# EAGLE design Teensy_backpack_proto (EAGLE 8.0.1)
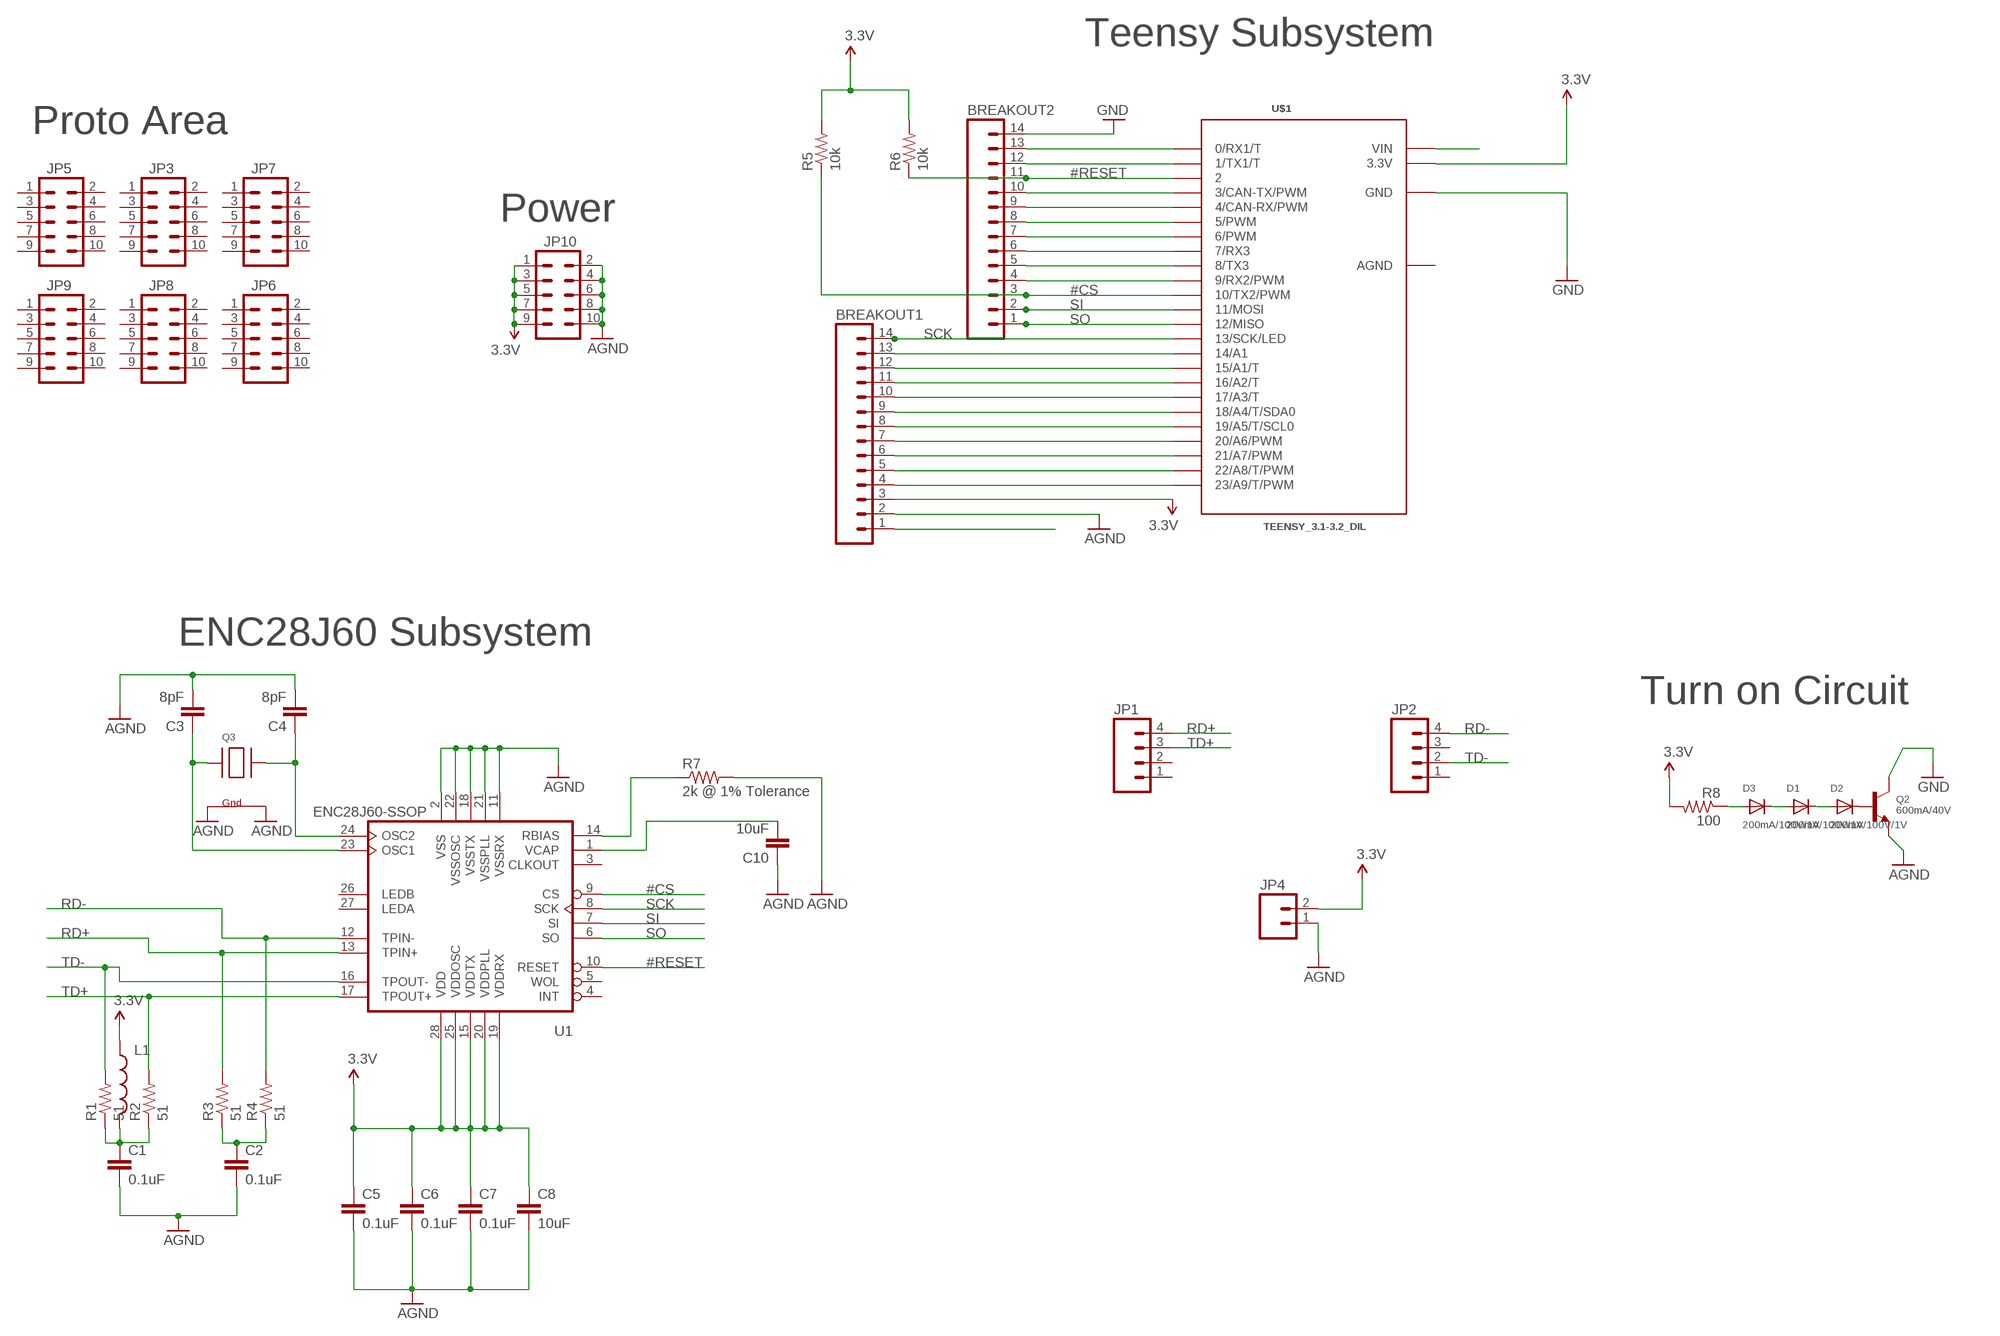
[diagram p0: schematic, sheet 1]

## Parts
BREAKOUT1  M14  [1X14]
BREAKOUT2  M14  [1X14]
C1  0.1uF  CAP0603-CAP  [0603-CAP]
C2  0.1uF  CAP0603-CAP  [0603-CAP]
C3  8pF  CAP0603-CAP  [0603-CAP]
C4  8pF  CAP0603-CAP  [0603-CAP]
C5  0.1uF  CAP0603-CAP  [0603-CAP]
C6  0.1uF  CAP0603-CAP  [0603-CAP]
C7  0.1uF  CAP0603-CAP  [0603-CAP]
C8  10uF  CAP0603-CAP  [0603-CAP]
C10  10uF  CAP0603-CAP  [0603-CAP]
D1  200mA/100V/1V  DIODESOD-123  [SOD-123]
D2  200mA/100V/1V  DIODESOD-123  [SOD-123]
D3  200mA/100V/1V  DIODESOD-123  [SOD-123]
JP1  M04NO_SILK_ALL_ROUND  [1X04_NO_SILK_ALL_ROUND]
JP2  M04NO_SILK_ALL_ROUND  [1X04_NO_SILK_ALL_ROUND]
JP3  M05X2NO_SILK  [2X5_NOSILK]
JP4  M021X02_NO_SILK  [1X02_NO_SILK]
JP5  M05X2NO_SILK  [2X5_NOSILK]
JP6  M05X2NO_SILK  [2X5_NOSILK]
JP7  M05X2NO_SILK  [2X5_NOSILK]
JP8  M05X2NO_SILK  [2X5_NOSILK]
JP9  M05X2NO_SILK  [2X5_NOSILK]
JP10  M05X2NO_SILK  [2X5_NOSILK]
L1  INDUCTOR0603  [0603]
Q2  600mA/40V  TRANSISTOR_NPN  [SOT23-R]
Q3  XTAL-4-3225  [NX3225]
R1  51  RESISTOR0603  [0603-RES]
R2  51  RESISTOR0603  [0603-RES]
R3  51  RESISTOR0603  [0603-RES]
R4  51  RESISTOR0603  [0603-RES]
R5  10k  RESISTOR0603  [0603-RES]
R6  10k  RESISTOR0603  [0603-RES]
R7  2k @ 1% Tolerance  RESISTOR0603-RES  [0603-RES]
R8  100  RESISTOR0603  [0603-RES]
U1  ENC28J60-SSOP  [SSOP28]
U$1  TEENSY_3.1-3.2_DIL  [TEENSY_3.0-3.2&LC_DIL]

## Nets
3.3V: BREAKOUT1.3 C5.1 C6.1 C7.1 C8.1 JP4.2 JP10.1 JP10.3 JP10.5 JP10.7 JP10.9 L1.1 R5.2 R6.2 R8.2 U1.15(VDDTX) U1.19(VDDRX) U1.20(VDDPLL) U1.25(VDDOSC) U1.28(VDD) U$1.3.3V
#CS: BREAKOUT2.3 R5.1 U1.9(CS) U$1.10(10/TX2/PWM)
#RESET: BREAKOUT2.11 R6.1 U1.10(RESET) U$1.2
AGND: BREAKOUT1.2 C1.2 C2.2 C3.2 C4.2 C5.2 C6.2 C7.2 C8.2 C10.1 JP4.1 JP10.2 JP10.4 JP10.6 JP10.8 JP10.10 Q2.2(E) Q3.2(G2) Q3.4(G1) R7.2 U1.2(VSS) U1.11(VSSRX) U1.18(VSSTX) U1.21(VSSPLL) U1.22(VSSOSC)
GND: BREAKOUT2.14 Q2.3(C) U$1.GND
N$1: D1.C D2.A
N$2: D2.C Q2.1(B)
N$3: D1.A D3.C
N$4: D3.A R8.1
N$5: C2.1 R3.1 R4.1
N$6: BREAKOUT2.4 U$1.9(9/RX2/PWM)
N$7: C1.1 L1.2 R1.1 R2.1
N$8: BREAKOUT2.5 U$1.8(8/TX3)
N$9: BREAKOUT2.6 U$1.7(7/RX3)
N$10: BREAKOUT2.7 U$1.6(6/PWM)
N$11: BREAKOUT2.8 U$1.5(5/PWM)
N$12: C3.1 Q3.1(X1) U1.23(OSC1)
N$13: C4.1 Q3.3(X2) U1.24(OSC2)
N$14: BREAKOUT2.9 U$1.4(4/CAN-RX/PWM)
N$15: R7.1 U1.14(RBIAS)
N$16: BREAKOUT2.10 U$1.3(3/CAN-TX/PWM)
N$17: C10.2 U1.1(VCAP)
N$18: BREAKOUT2.12 U$1.1(1/TX1/T)
N$19: BREAKOUT2.13 U$1.0(0/RX1/T)
N$20: BREAKOUT1.4 U$1.23/A9(23/A9/T/PWM)
N$21: BREAKOUT1.5 U$1.22/A8(22/A8/T/PWM)
N$22: BREAKOUT1.6 U$1.21/A7(21/A7/PWM)
N$23: BREAKOUT1.7 U$1.20/A6(20/A6/PWM)
N$24: BREAKOUT1.8 U$1.19/A5(19/A5/T/SCL0)
N$25: BREAKOUT1.9 U$1.18/A4(18/A4/T/SDA0)
N$26: BREAKOUT1.10 U$1.17/A3(17/A3/T)
N$27: BREAKOUT1.11 U$1.16/A2(16/A2/T)
N$28: BREAKOUT1.12 U$1.15/A1(15/A1/T)
N$29: BREAKOUT1.13 U$1.14/A0(14/A1)
RD+: JP1.4 R3.2 U1.13(TPIN+)
RD-: JP2.4 R4.2 U1.12(TPIN-)
SCK: BREAKOUT1.14 U1.8(SCK) U$1.13(13/SCK/LED)
SI: BREAKOUT2.2 U1.7(SI) U$1.11(11/MOSI)
SO: BREAKOUT2.1 U1.6(SO) U$1.12(12/MISO)
TD+: JP1.3 R2.2 U1.17(TPOUT+)
TD-: JP2.2 R1.2 U1.16(TPOUT-)
TEENSY_VIN: BREAKOUT1.1 U$1.VIN
Unconnected: JP1.1 JP1.2 JP2.1 JP2.3 JP3.1 JP3.2 JP3.3 JP3.4 JP3.5 JP3.6 JP3.7 JP3.8 JP3.9 JP3.10 JP5.1 JP5.2 JP5.3 JP5.4 JP5.5 JP5.6 JP5.7 JP5.8 JP5.9 JP5.10 JP6.1 JP6.2 JP6.3 JP6.4 JP6.5 JP6.6 JP6.7 JP6.8 JP6.9 JP6.10 JP7.1 JP7.2 JP7.3 JP7.4 JP7.5 JP7.6 JP7.7 JP7.8 JP7.9 JP7.10 JP8.1 JP8.2 JP8.3 JP8.4 JP8.5 JP8.6 JP8.7 JP8.8 JP8.9 JP8.10 JP9.1 JP9.2 JP9.3 JP9.4 JP9.5 JP9.6 JP9.7 JP9.8 JP9.9 JP9.10 U1.3(CLKOUT) U1.4(INT) U1.5(WOL) U1.26(LEDB) U1.27(LEDA)

## Notes on the sheet
- Teensy Subsystem
- Proto Area
- Power
- ENC28J60 Subsystem
- Turn on Circuit

## Power pins joined to a net without a drawn wire
AGND: U$1.AGND

## Library data of the parts
BREAKOUT1 BREAKOUT2 = SparkFun-Connectors:M14: Header 14 Standard 14-pin 0.1" header. Use with straight break away headers (SKU : PRT-00116), right angle break away headers (PRT-00553), swiss pins (PRT-00743), machine pins (PRT-00117), and female headers (PRT-00115).
C1 C2 C5-C7 = SparkFun-Capacitors:CAP: Capacitor Standard 0603 ceramic capacitor, and 0.1" leaded capacitor.
C3 C4 C8 C10 = SparkFun-Passives:CAP: Capacitor Standard 0603 ceramic capacitor, and 0.1" leaded capacitor.
D1-D3 = adafruit:DIODE: Diode SMADIODE - SMA Surface Mount Package 20V 1A Schottky Diode Digikey: 641-1014-6-ND DO-1N4148 - Through Hole Small Current Diode SOD-123 20V 1 A (.5mV Vf) Schottky Diode - Digikey: MBRX120TPMSCT-ND SOD-323 10V 570mA (.38mV Vf, 3ns) Schottky Diode - Digikey: ZLLS410CT-ND SOD-523 30V 30mA Schottky Diode (RB751S-40TE61) - Digikey: RB751S-40TE61CT-ND SOT23-R/W - SOT23 Package (R = Solder Paste/Reflow Ovens, W = Hand-Soldering) BAT54Film 40V 300mA - Digikey: 497-7162-1-ND
JP1 JP2 = SparkFun-Connectors:M04: Header 4 Standard 4-pin 0.1" header. Use with straight break away headers (SKU : PRT-00116), right angle break away headers (PRT-00553), swiss pins (PRT-00743), machine pins (PRT-00117), and female headers (PRT-00115). Molex polarized connector foot print use with SKU : PRT-08231 with associated crimp pins and housings. 1MM SMD Version SKU: PRT-10208
JP3 JP5-JP10 = SparkFun-Connectors:M05X2: Header 5x2 Standard 10-pin dual row 0.1" header. Commonly used with AVR-ISP. Use with Spark Fun Electronics SKU: PRT-00778
JP4 = SparkFun-Connectors:M02: Standard 2-pin 0.1" header. Use with - straight break away headers ( PRT-00116) - right angle break away headers (PRT-00553) - swiss pins (PRT-00743) - machine pins (PRT-00117) - female headers (PRT-00115) Molex polarized connector foot print use with: PRT-08233 with associated crimp pins and housings. 2.54_SCREWTERM for use with PRT-10571. 3.5mm Screw Terminal footprints for PRT-08084 5mm Screw Terminal footprints for use with PRT-08432
L1 = SparkFun-Passives:INDUCTOR: Inductors Basic Inductor/Choke - 0603 and 1206. Footprints are not proven and vary greatly between part numbers. INDUCTOR POWER 3.3UH 4.0A SMD 0.197" L x 0.197" W x 0.177" H (5.00mm x 5.00mm x 4.50mm)
Q2 = microbuilder:TRANSISTOR_NPN: NPN Transistor Transistor (NPN) 500mA 45V - BC817 [Digikey: 568-1631-1-ND] Transistor (NPN) 500mA 45V - BC817,215 [Mouser: 771-BC817-T/R] SOT23-R - SOT23 footprint optimised for use with solder paste and reflow ovens. SOT23-W - SOT23 footprint optimised for hand-soldering (larger pads).
Q3 = adafruit:XTAL-4: Classic 4-pin 3.2 x 2.5mm crystal
R1-R6 R8 = SparkFun-Resistors:RESISTOR: Resistor Basic schematic elements and footprints for 0603, 1206, and PTH resistors.
R7 = SparkFun-Passives:RESISTOR: Resistor Basic schematic elements and footprints for 0603, 1206, and PTH resistors.
U1 = microchip-enc28j60:ENC28J60-*: Microchip 10Mbit Eth. contoller with SPI interface
U$1 = Teensy_3_and_LC_Series_Boards_v1.4:TEENSY_3.1-3.2_DIL: Teensy 3.1 or 3.2 in a DIL Layout.

## Board
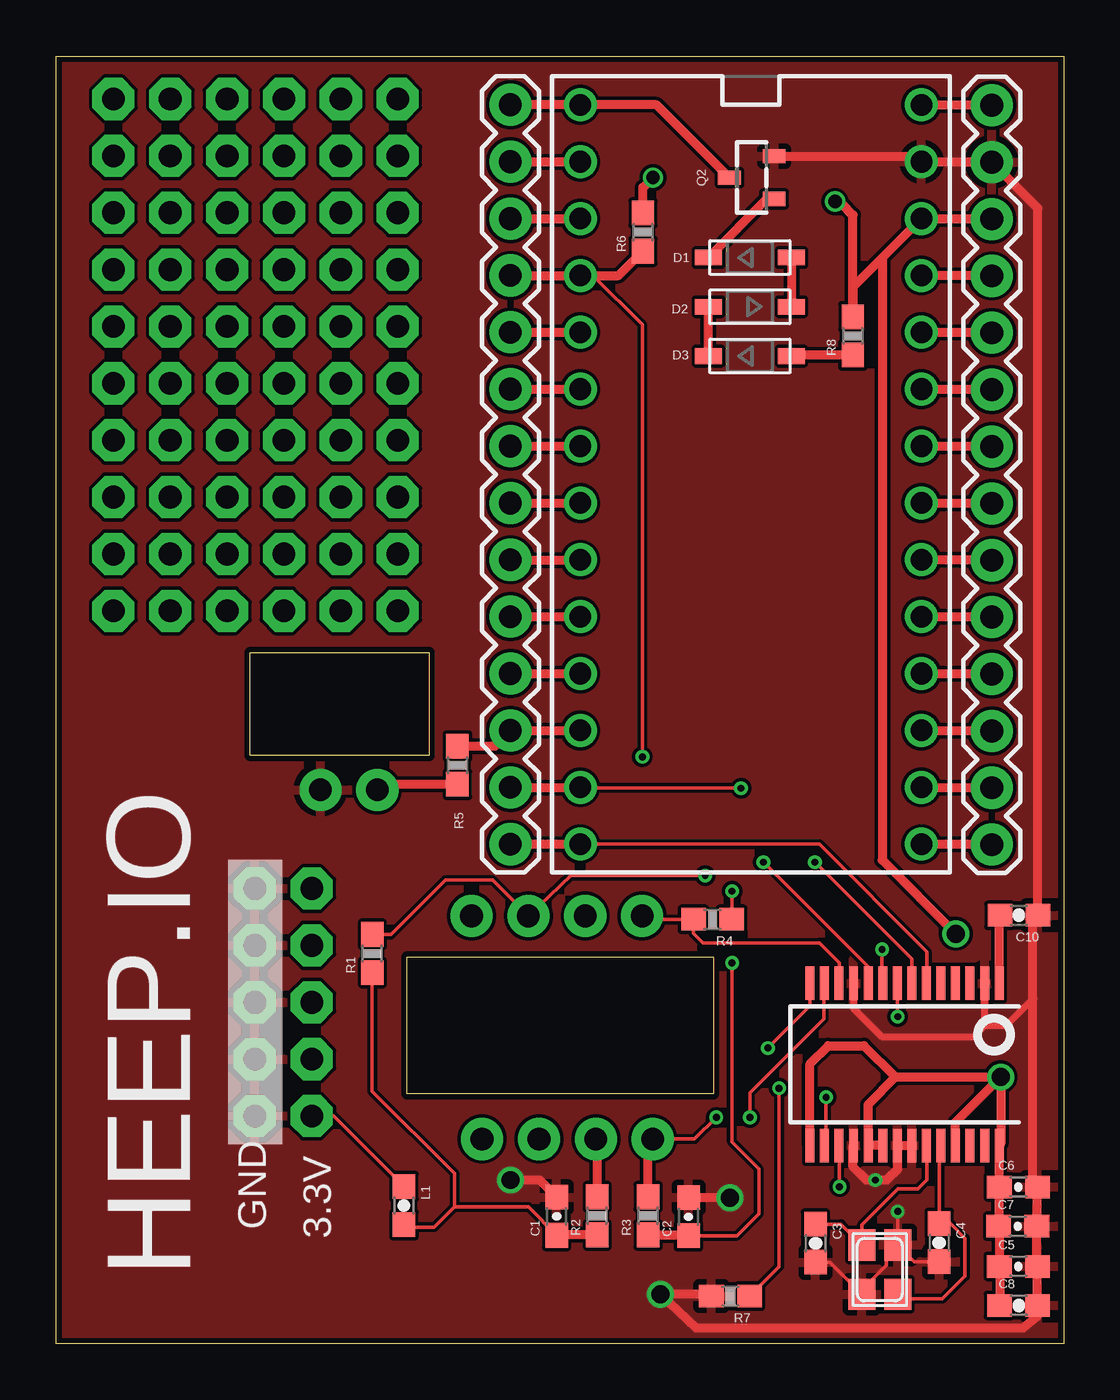
[diagram p1: board, top side]
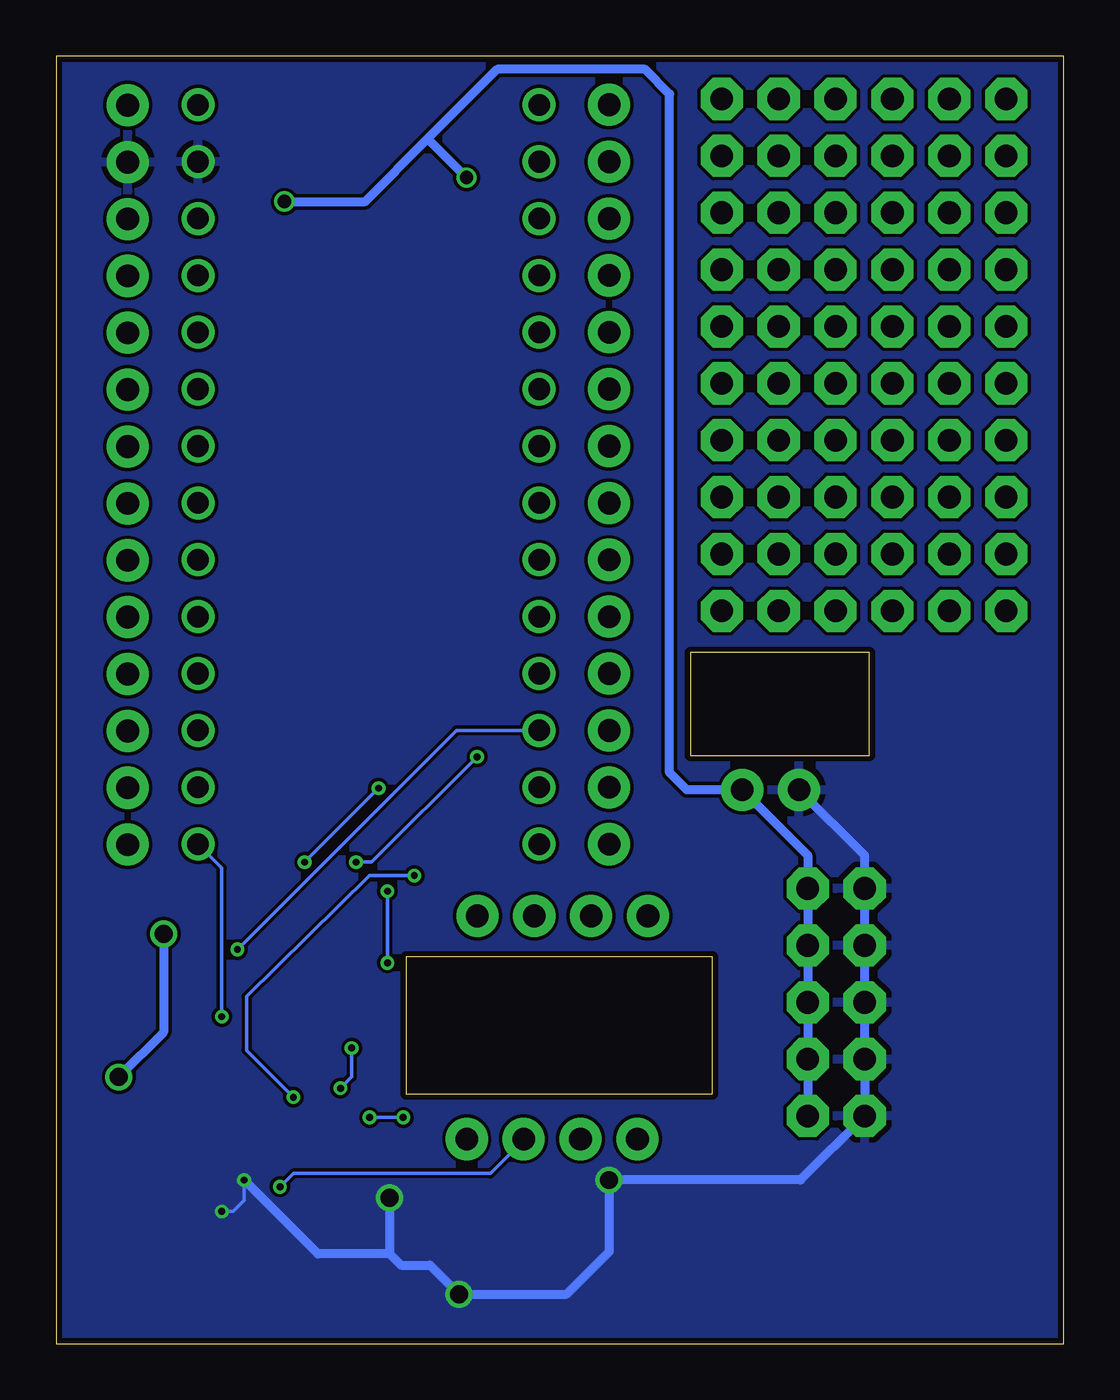
[diagram p2: board, bottom side, seen from below]

Size 45 x 57.5 mm. Coordinates in mm from the lower left corner, seen from the top.
Outline: 45,0 0,0 0,57.5 45,57.5 45,0
Outline: 29.37,11.15 15.67,11.15 15.67,17.27 29.37,17.27 29.37,11.15
Outline: 16.66,26.27 8.66,26.27 8.66,30.87 16.66,30.87 16.66,26.27
Copper layers (1*16): Top 0.035mm / dielectric 1.5mm / Bottom 0.035mm
Design rules "SeeedStudio_2layer_DRU_no_angle_20140221": minimum track width 6mil, minimum drill 12mil, track to track 6mil, track to pad 6mil, pad to pad 6mil, via to via 6mil, smd to smd 0mil, copper to edge 10mil, drill to drill 10mil, minimum pad ring 10mil, minimum via ring 6mil, stop-mask expansion 2mil, vias tented up to drill 100mil, thermal gap 10mil

### Footprints (pad centres in the part's own frame; a part is rotated, then mirrored left to right if it is on the bottom)
1X14 = drill 1.016 pad 1.88: 1 0,0; 2 2.54,0; 3 5.08,0; 4 7.62,0; 5 10.16,0; 6 12.7,0; 7 15.24,0; 8 17.78,0; 9 20.32,0; 10 22.86,0; 11 25.4,0; 12 27.94,0; 13 30.48,0; 14 33.02,0
0603-CAP = smd 1.1 x 1: 1 -0.85,0; 2 0.85,0
SOD-123 = smd 1.2 x 0.7: A 1.85,0; C -1.85,0
1X04_NO_SILK_ALL_ROUND = drill 1.016 pad 1.88: 1 0,0; 2 2.54,0; 3 5.08,0; 4 7.62,0
2X5_NOSILK = drill 1.016 pad 1.88 octagon: 1 -1.27,5.08; 2 1.27,5.08; 3 -1.27,2.54; 4 1.27,2.54; 5 -1.27,0; 6 1.27,0; 7 -1.27,-2.54; 8 1.27,-2.54; 9 -1.27,-5.08; 10 1.27,-5.08
1X02_NO_SILK = drill 1.016 pad 1.88: 1 0,0; 2 2.54,0
0603 = smd 1.1 x 1: 1 -0.85,0; 2 0.85,0
SOT23-R = smd 0.635 x 1.016: 1 -0.95,-1; 2 0.95,-1; 3 0,1
NX3225 = smd 1.4 x 1.2: 1 -1.1,-0.8; 2 1.1,-0.8; 3 1.1,0.8; 4 -1.1,0.8
0603-RES = smd 1.1 x 1: 1 -0.85,0; 2 0.85,0
SSOP28 = smd 0.4 x 1.5: 1 -4.225,-3.625; 2 -3.575,-3.625; 3 -2.925,-3.625; 4 -2.275,-3.625; 5 -1.625,-3.625; 6 -0.975,-3.625; 7 -0.325,-3.625; 8 0.325,-3.625; 9 0.975,-3.625; 10 1.625,-3.625; 11 2.275,-3.625; 12 2.925,-3.625; 13 3.575,-3.625; 14 4.225,-3.625; 15 4.225,3.625; 16 3.575,3.625; 17 2.925,3.625; 18 2.275,3.625; 19 1.625,3.625; 20 0.975,3.625; 21 0.325,3.625; 22 -0.325,3.625; 23 -0.975,3.625; 24 -1.625,3.625; 25 -2.275,3.625; 26 -2.925,3.625; 27 -3.575,3.625; 28 -4.225,3.625
TEENSY_3.0-3.2&LC_DIL = drill 0.965: 0 -7.62,13.97; 1 -7.62,11.43; 2 -7.62,8.89; 3 -7.62,6.35; 3.3V 7.62,11.43; 4 -7.62,3.81; 5 -7.62,1.27; 6 -7.62,-1.27; 7 -7.62,-3.81; 8 -7.62,-6.35; 9 -7.62,-8.89; 10 -7.62,-11.43; 11 -7.62,-13.97; 12 -7.62,-16.51; 13 7.62,-16.51; 14/A0 7.62,-13.97; 15/A1 7.62,-11.43; 16/A2 7.62,-8.89; 17/A3 7.62,-6.35; 18/A4 7.62,-3.81; 19/A5 7.62,-1.27; 20/A6 7.62,1.27; 21/A7 7.62,3.81; 22/A8 7.62,6.35; 23/A9 7.62,8.89; AGND 7.62,13.97; GND -7.62,16.51; VIN 7.62,16.51

### Placement (x,y rotation side)
BREAKOUT1  41.79,55.3 270 top
BREAKOUT2  20.29,22.3 90 top
C1  22.36,5.68 90 top
C2  28.25,5.67 90 top
C3  33.92,4.48 270 top
C4  39.44,4.51 270 top
C5  42.98,3.44 0 top
C6  42.98,6.99 0 top
C7  42.95,5.24 0 top
C8  42.99,1.7 0 top
C10  43.01,19.12 180 top
D1  30.99,46.3 180 top
D2  30.99,48.5 0 top
D3  30.99,44.1 0 top
JP1  19.03,9.13 0 top
JP2  18.56,19.09 0 top
JP3  3.83,50.5 0 top
JP4  11.81,24.73 0 top
JP5  8.91,50.5 0 top
JP6  3.83,37.8 0 top
JP7  13.99,50.5 180 top
JP8  8.91,37.8 0 top
JP9  13.99,37.8 0 top
JP10  10.15,15.24 180 top
L1  15.54,6.16 270 top
Q2  31.08,52.07 90 top
Q3  36.79,3.3 270 top
R1  14.13,17.42 90 top
R2  24.17,5.7 90 top
R3  26.45,5.7 90 top
R4  29.33,18.94 180 top
R5  17.93,25.83 270 top
R6  26.21,49.64 90 top
R7  30.13,2.11 180 top
R8  35.59,45 90 top
U1  37.9,12.47 180 top
U$1  31.04,38.81 0 top

### Tracks (layer width: path | path; a pad name or v marks a point on that pad's centre or on a via)
3.3V  (via drill 0.6, 0.8)
  Top 0.152: L1.1 12.39,10.16 JP10.1
  Top 0.406: C8.1 C5.1 42.13,5.24 C7.1 42.13,5.24 C6.1 U1.28 42.19,8.91 v42.19,11.9 | 36.9,48.49 35.59,47.18 R8.2 35.59,50.4 35.09,50.9 34.89,50.9 v34.79,51 | 36.9,48.49 U$1.3.3V 41.77,50.24 BREAKOUT1.3 | R6.2 26.21,51.62 v26.66,52.07 | 36.9,48.49 36.9,21.59 v40.19,18.3 | U1.25 40.17,9.88 v42.19,11.9 | 37.49,11.9 36.27,10.68 U1.19 U1.20 | 37.49,11.9 v42.19,11.9 | U1.15 33.67,12.48 34.49,13.3 36.09,13.3 37.49,11.9 | R5.2 14.6,24.98 JP4.2
  Bottom 0.406: v34.79,51 31.19,51 28.39,53.8 | 28.39,53.8 25.29,56.9 18.69,56.9 17.59,55.8 17.59,25.5 16.82,24.73 JP4.2 11.42,21.8 JP10.9 JP10.7 JP10.5 JP10.3 JP10.1 | v26.66,52.07 28.39,53.8 | v40.19,18.3 40.19,13.9 v42.19,11.9
#CS  (via drill 0.3)
  Top 0.152: v36.89,17.6 36.89,16.12 U1.9
  Top 0.406: U$1.10 BREAKOUT2.3 19.59,26.68 R5.1
  Bottom 0.152: U$1.10 27.11,27.38 v36.89,17.6
#RESET  (via drill 0.3)
  Top 0.152: U1.10 36.27,16.82 v31.59,21.5 | v26.19,26.2 26.19,45.5 23.99,47.7
  Top 0.406: BREAKOUT2.11 U$1.2 23.99,47.7 25.13,47.7 R6.1
  Bottom 0.152: v31.59,21.5 30.89,21.5 v26.19,26.2
AGND  (via drill 0.3, 0.8)
  Top 0.152: C3.2 34.56,3.63 Q3.2 35.99,2.4 37.09,3.5 37.09,3.9 Q3.4 | C4.2 38.33,3.66 Q3.4 | Q3.4 v37.59,5.9
  Top 0.305: U1.11 35.62,14.97 36.89,13.7 40.99,13.7 41.49,14.2 | 41.49,14.2 41.49,16.07 U1.2 | 41.49,14.2 42.43,14.2 43.63,15.4
  Top 0.406: Q2.2 38.42,53.02 U$1.AGND 38.68,52.76 BREAKOUT1.2 43.86,50.7 C10.1 43.63,18.9 43.63,15.4 43.63,7.19 C6.2 43.83,5.24 C7.2 43.8,3.44 C5.2 C8.2 43.84,1.25 43.19,0.7 28.59,0.7 v26.99,2.2 29.19,2.2 R7.2 | U1.22 U1.21 37.59,8.82 37.59,7.8 37.09,7.3 v36.59,7.3 36.19,7.3 35.59,7.9 35.59,8.81 U1.18 | v20.29,7.3 21.6,7.3 C1.2 | C2.2 30.07,6.52 v30.09,6.5
  Bottom 0.152: JP10.2 | v36.59,7.3 36.59,6.4 37.09,5.9 v37.59,5.9
  Bottom 0.406: JP4.1 8.88,21.8 JP10.10 JP10.8 JP10.6 JP10.4 JP10.2 11.74,7.3 v20.29,7.3 20.29,4.1 22.19,2.2 v26.99,2.2 28.29,3.5 29.59,3.5 30.09,4 | v30.09,6.5 30.09,4 | 30.09,4 33.29,4 v36.59,7.3
  pour Top: -7.91,59.4 49.19,59.4 49.19,-3.3 -7.81,-3.3 -7.91,-3.3
  pour Bottom: -9.01,59.4 48.09,59.4 48.09,-3.3 -8.91,-3.3 -9.01,-3.3
GND
  Top 0.406: Q2.3 26.82,55.32 U$1.GND BREAKOUT2.14
N$1
  Top 0.406: D2.A D1.C
N$2
  Top 0.406: Q2.1 31.76,51.12 D2.C
N$3
  Top 0.406: D3.C D1.A
N$4
  Top 0.406: R8.1 32.89,44.15 D3.A
N$5  (via drill 0.3)
  Top 0.152: v30.19,20.2 30.19,18.96 R4.1 | C2.1 30.41,4.82 31.39,5.8 31.39,7.8 30.19,9 v30.19,17
  Top 0.406: R3.1 28.22,4.85 C2.1
  Bottom 0.152: v30.19,17 v30.19,20.2
N$6
  Top 0.406: BREAKOUT2.4 U$1.9
N$7
  Top 0.152: R1.1 14.13,11.26 17.79,7.6 17.79,6.1 | 17.79,6.1 16.89,5.2 15.65,5.2 L1.2 | 17.79,6.1 21.1,6.1 C1.1
  Top 0.406: R2.1 22.38,4.85 C1.1
N$8
  Top 0.406: BREAKOUT2.5 U$1.8
N$9
  Top 0.406: BREAKOUT2.6 U$1.7
N$10
  Top 0.406: BREAKOUT2.7 U$1.6
N$11
  Top 0.406: BREAKOUT2.8 U$1.5
N$12
  Top 0.152: C3.1 35.06,5.33 Q3.1 35.99,5.3 37.59,6.9 38.49,6.9 38.89,7.3 38.89,8.82 U1.23
N$13
  Top 0.152: U1.24 39.44,8.76 C4.1 39.93,5.36 40.59,4.7 40.59,3 39.59,2 37.79,2 Q3.3
N$14
  Top 0.406: BREAKOUT2.9 U$1.4
N$15  (via drill 0.3)
  Top 0.152: U1.14 33.67,15.08 v31.79,13.2 | v32.29,11.4 32.29,3.43 R7.1
  Bottom 0.152: v31.79,13.2 31.79,11.9 v32.29,11.4
N$16
  Top 0.406: BREAKOUT2.10 U$1.3
N$17
  Top 0.406: U1.1 42.12,19.09 C10.2
N$18
  Top 0.406: BREAKOUT2.12 U$1.1
N$19
  Top 0.406: BREAKOUT2.13 U$1.0
N$20
  Top 0.406: BREAKOUT1.4 38.68,47.68 U$1.23/A9
N$21
  Top 0.406: U$1.22/A8 41.77,45.16 BREAKOUT1.5
N$22
  Top 0.406: BREAKOUT1.6 38.68,42.6 U$1.21/A7
N$23
  Top 0.406: U$1.20/A6 41.77,40.08 BREAKOUT1.7
N$24
  Top 0.406: U$1.19/A5 41.77,37.54 BREAKOUT1.8
N$25
  Top 0.406: BREAKOUT1.9 38.68,34.98 U$1.18/A4
N$26
  Top 0.406: U$1.17/A3 41.77,32.46 BREAKOUT1.10
N$27
  Top 0.406: BREAKOUT1.11 38.68,29.9 U$1.16/A2
N$28
  Top 0.406: U$1.15/A1 41.77,27.38 BREAKOUT1.12
N$29
  Top 0.406: BREAKOUT1.13 38.68,24.82 U$1.14/A0
RD+  (via drill 0.3)
  Top 0.152: JP1.4 28.53,9.13 v29.49,10.1 | v30.99,10.1 30.99,11.2 34.29,14.5 34.29,16.06 U1.13
  Top 0.406: R3.2 26.45,8.93 JP1.4
  Bottom 0.152: v29.49,10.1 v30.99,10.1
RD-
  Top 0.152: JP2.4 26.33,18.94 R4.2 28.48,18.31 28.89,17.9 34.09,17.9 34.99,17 34.99,16.11 U1.12
SCK  (via drill 0.3)
  Top 0.152: U1.8 37.57,14.62 v37.59,14.6
  Top 0.406: U$1.13 41.77,22.3 BREAKOUT1.14
  Bottom 0.152: v37.59,14.6 37.59,21.24 U$1.13
SI  (via drill 0.3)
  Top 0.152: U1.7 38.22,17.17 v33.89,21.5 | v30.59,24.8 23.46,24.8 U$1.11
  Top 0.406: BREAKOUT2.2 U$1.11
  Bottom 0.152: v33.89,21.5 v30.59,24.8
SO
  Top 0.152: U$1.12 34.09,22.3 38.89,17.5 38.89,16.11 U1.6
  Top 0.406: BREAKOUT2.1 U$1.12
TD+  (via drill 0.3)
  Top 0.152: v34.99,7 34.99,8.82 U1.17
  Top 0.406: R2.2 24.17,9.07 JP1.3
  Bottom 0.152: JP1.3 24.11,9.08 25.59,7.6 34.39,7.6 v34.99,7
TD-  (via drill 0.3)
  Top 0.152: R1.2 14.96,18.27 17.39,20.7 19.49,20.7 JP2.2 23,20.9 v28.99,20.9 | v34.39,11 34.39,8.91 U1.16
  Bottom 0.152: v28.99,20.9 30.99,20.9 36.49,15.5 36.49,13.1 v34.39,11
TEENSY_VIN
  Top 0.406: BREAKOUT1.1 38.68,55.3 U$1.VIN

### Text on the board
tPlace: HEEP.IO | GND | 3.3V